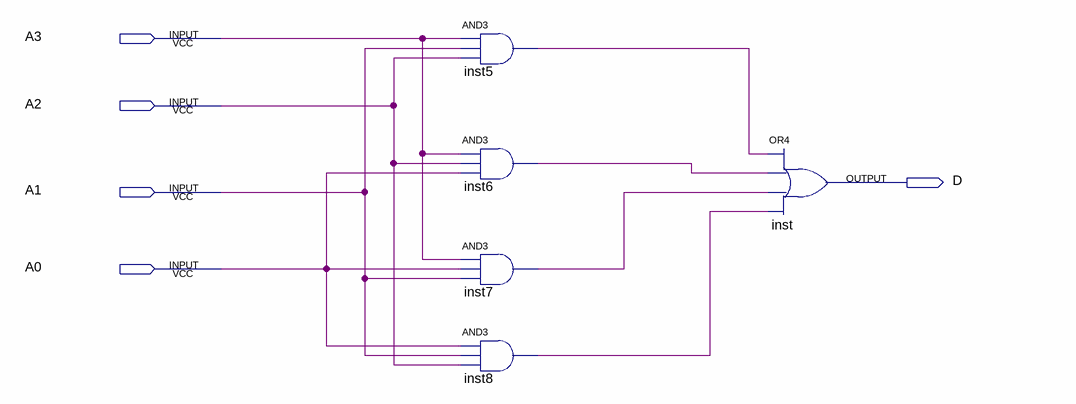
[diagram p0: schematic sheet]
// Quartus schematic Ex3.bdf as structural Verilog: 5 symbols, 5 pins
module Ex3 (
  input  A3,
  input  A2,
  input  A1,
  input  A0,
  output D
);

  wire inst5_out, inst6_out, inst7_out, inst8_out;

  and inst5 (inst5_out, A3, A1, A2);
  and inst6 (inst6_out, A3, A2, A0);
  and inst7 (inst7_out, A3, A0, A1);
  and inst8 (inst8_out, A0, A1, A2);
  or inst (D, inst5_out, inst6_out, inst7_out, inst8_out);
endmodule
